# Altium schematic sheet DVT-Volga-V2.SchDoc: DVT Volga V2
size A4; Revision: 1; SheetNumber: 1; SheetTotal: 1; PartNumber: PN0054; Drawn By: Sebastian Kulik; ProjectName: DVT Volga V2
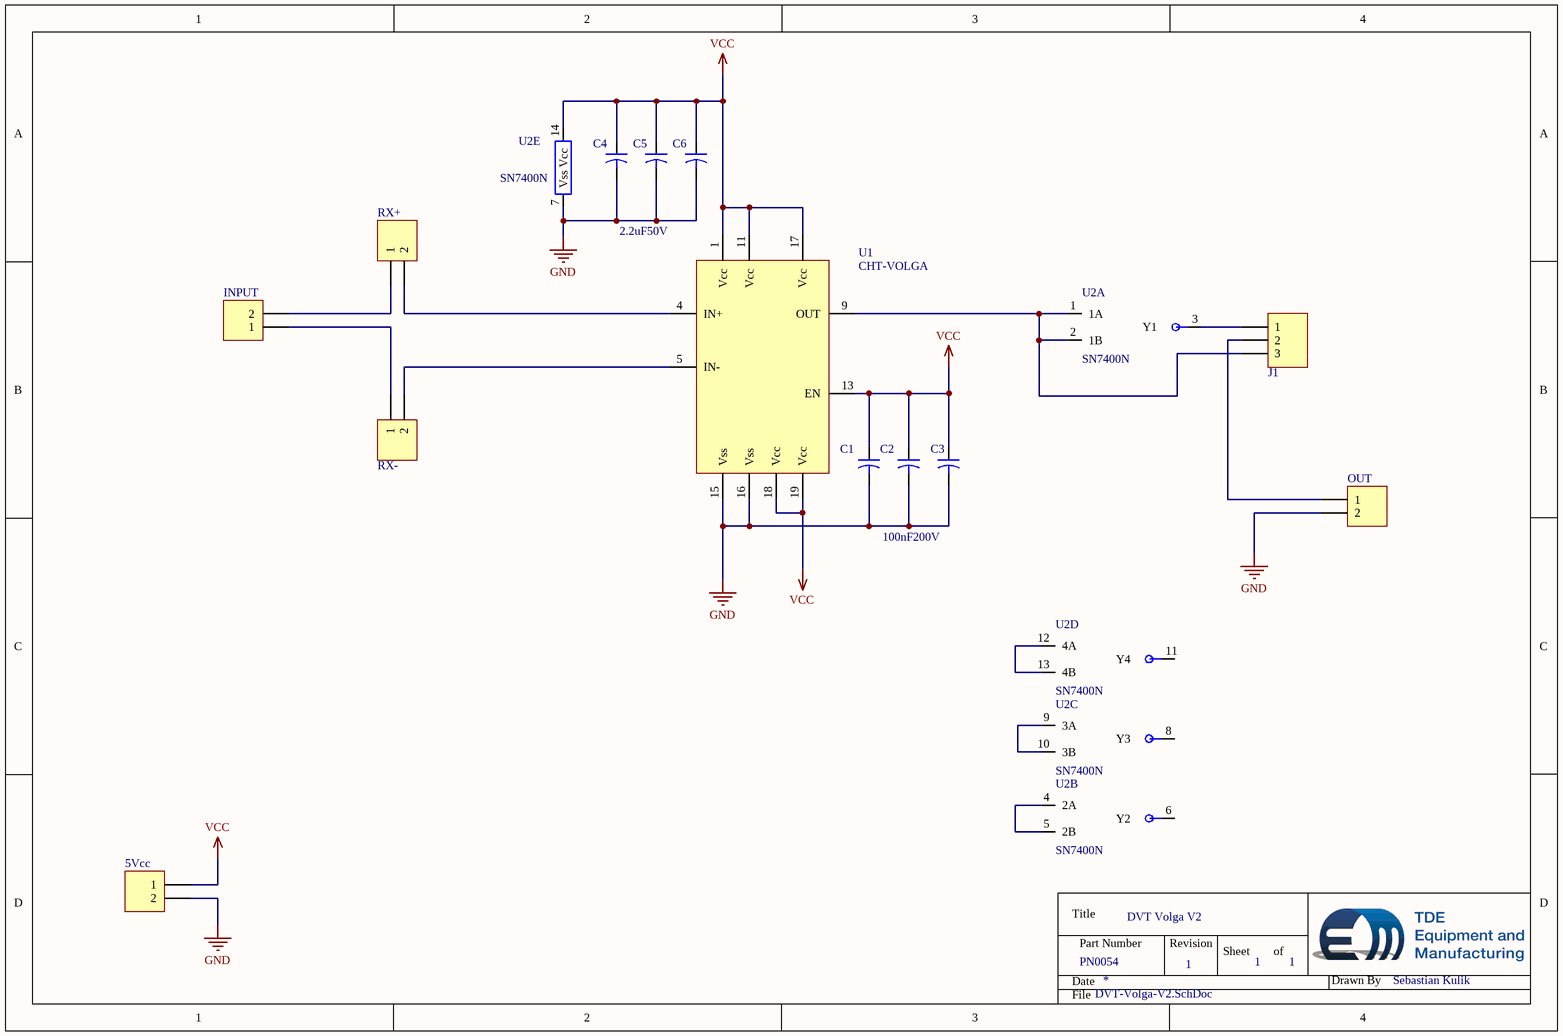
[diagram p0: DVT-Volga-V2.SchDoc]

## Parts
5Vcc  PHOENIX_1715721  [Phoenix-2-5_08]  (value not drawn)
C1  value 100nF200V  [Dummy-10mm]  (hidden comment: Capacitor-Dummy-THT)
C2  Capacitor-Dummy-THT  [Dummy-10mm]  (value not drawn)
C3  Capacitor-Dummy-THT  [Dummy-10mm]  (value not drawn)
C4  Capacitor-Dummy-THT  [Dummy-10mm]  (value not drawn)
C5  Capacitor-Dummy-THT  [Dummy-10mm]  (value not drawn)
C6  value 2.2uF50V  [Dummy-10mm]  (hidden comment: Capacitor-Dummy-THT)
INPUT  PHOENIX_1715721  [Phoenix-2-5_08]  (value not drawn)
J1  Header-3  [HDR1X3]  (value not drawn)
OUT  PHOENIX_1715721  [Phoenix-2-5_08]  (value not drawn)
RX+  PHOENIX_1715721  [HDR1X2]  (value not drawn)
RX-  PHOENIX_1715721  [HDR1X2]  (value not drawn)
U1  CHT-VOLGA  [TDFP16]
U2  SN7400N  [DIP-14]  (parts A,B,C,D,E of 5)

## Nets
GND: 5Vcc.2 C1.2 C2.2 C3.2 C4.2 C5.2 C6.2 OUT.2 U1.15(Vss) U1.16(Vss) U2.7(Vss)
VCC: 5Vcc.1 C1.1 C2.1 C3.1 C4.1 C5.1 C6.1 U1.1(Vcc) U1.11(Vcc) U1.13(EN) U1.17(Vcc) U1.18(Vcc) U1.19(Vcc) U2.14(Vcc)
NetINPUT_1: INPUT.1 RX-.1
NetINPUT_2: INPUT.2 RX+.1
NetJ1_1: J1.1 U2.3(Y1)
NetJ1_2: J1.2 OUT.1
NetJ1_3: J1.3 U1.9(OUT) U2.1(1A) U2.2(1B)
NetRX+_2: RX+.2 U1.4(IN+)
NetRX-_2: RX-.2 U1.5(IN-)
NetU2_4: U2.4(2A) U2.5(2B)
NetU2_9: U2.9(3A) U2.10(3B)
NetU2_12: U2.12(4A) U2.13(4B)

Not connected (* = marked no-connect by the designer): U2 6(Y2) 8(Y3) 11(Y4)

## Notes on the sheet
- Title
- Date
- Part Number
- Revision
- Sheet
- of
- Drawn By
- File

## Library data of the parts
5Vcc INPUT OUT = 2Pol_1715721: Phoenix, 2 pol, 5.08mm, 22A, 715721; Deliverer PartNr: 193-0564; Deliverer: RS; TDE-PN: CON0008; LatestRevisionDate: 02.05.2014; LatestRevisionNote: Re-released for DXP Platform.; Publisher: Sebastian Kulik; Manufacturer PartNr: 1715721; Manufacturer: Phoenix; PackageDescription: Phoenix-2-5_08; Price: 0.976/5
C1 = Capacitor-Dummy-THT: Deliverer PartNr: 2544877; Deliverer: Farnell; Published: 08.12.2015; Part Description: Capacitor-Dummy-THT; Publisher: Sebastian Kulik; PackageDescription: -; Manufacturer: -; Manufacturer PartNr: -; TDE-PN: -; Price: 0.51/10
C2 C3 = Capacitor-Dummy-THT: Deliverer PartNr: 2544877; Deliverer: Farnell; Value: 100nF200V; Published: 08.12.2015; Part Description: Capacitor-Dummy-THT; Publisher: Sebastian Kulik; PackageDescription: -; Manufacturer: -; Manufacturer PartNr: -; TDE-PN: -; Price: 0.51/10
C4 C5 = Capacitor-Dummy-THT: Deliverer PartNr: 2529490; Deliverer: Farnell; Value: 2.2uF50V; Published: 08.12.2015; Part Description: Capacitor-Dummy-THT; Publisher: Sebastian Kulik; PackageDescription: -; Manufacturer: -; Manufacturer PartNr: -; TDE-PN: -; Price: 1.28/1
C6 = Capacitor-Dummy-THT: Deliverer PartNr: 2529490; Deliverer: Farnell; Published: 08.12.2015; Part Description: Capacitor-Dummy-THT; Publisher: Sebastian Kulik; PackageDescription: -; Manufacturer: -; Manufacturer PartNr: -; TDE-PN: -; Price: 1.28/1
J1 = Header-3: Header-3-Pin; Publisher: Sebastian Kulik
RX+ RX- = Header-2: Header, 2-Pin; LatestRevisionDate: 18.02.2014; LatestRevisionNote: Re-released for DXP Platform.; Publisher: Sebastian Kulik
U1 = CHT-VOLGA: Comparator, Hi-Temp, 25MHz; Deliverer: CISSOID; TDE-PN: IC0080; Published: 01.08.2016; Deliverer PartNr: CHT-VOLGA; PackageDescription: DIP16; Publisher: Sebastian Kulik; Manufacturer PartNr: CHT-VOLGA; Manufacturer: CISSOID; Price: 204.93/5
U2 = SN7400N: Quad NAND, TTL; Deliverer PartNr: 305-490; Manufacturer: TI; Deliverer: RS; TDE-PN: IC0076; Published: 13.05.2016; PackageDescription: SOIC28; Publisher: Sebastian Kulik; Manufacturer PartNr: SN7400N; Price: 1.45